# EasyEDA schematic SCH_Revised Dice Roller_2023-06-08.json
TITLE: Sheet_1; REV: 1.0; Date: 2023-04-12; Sheet: 1/1; Drawn By: monkeybank2007; Company: Your Company
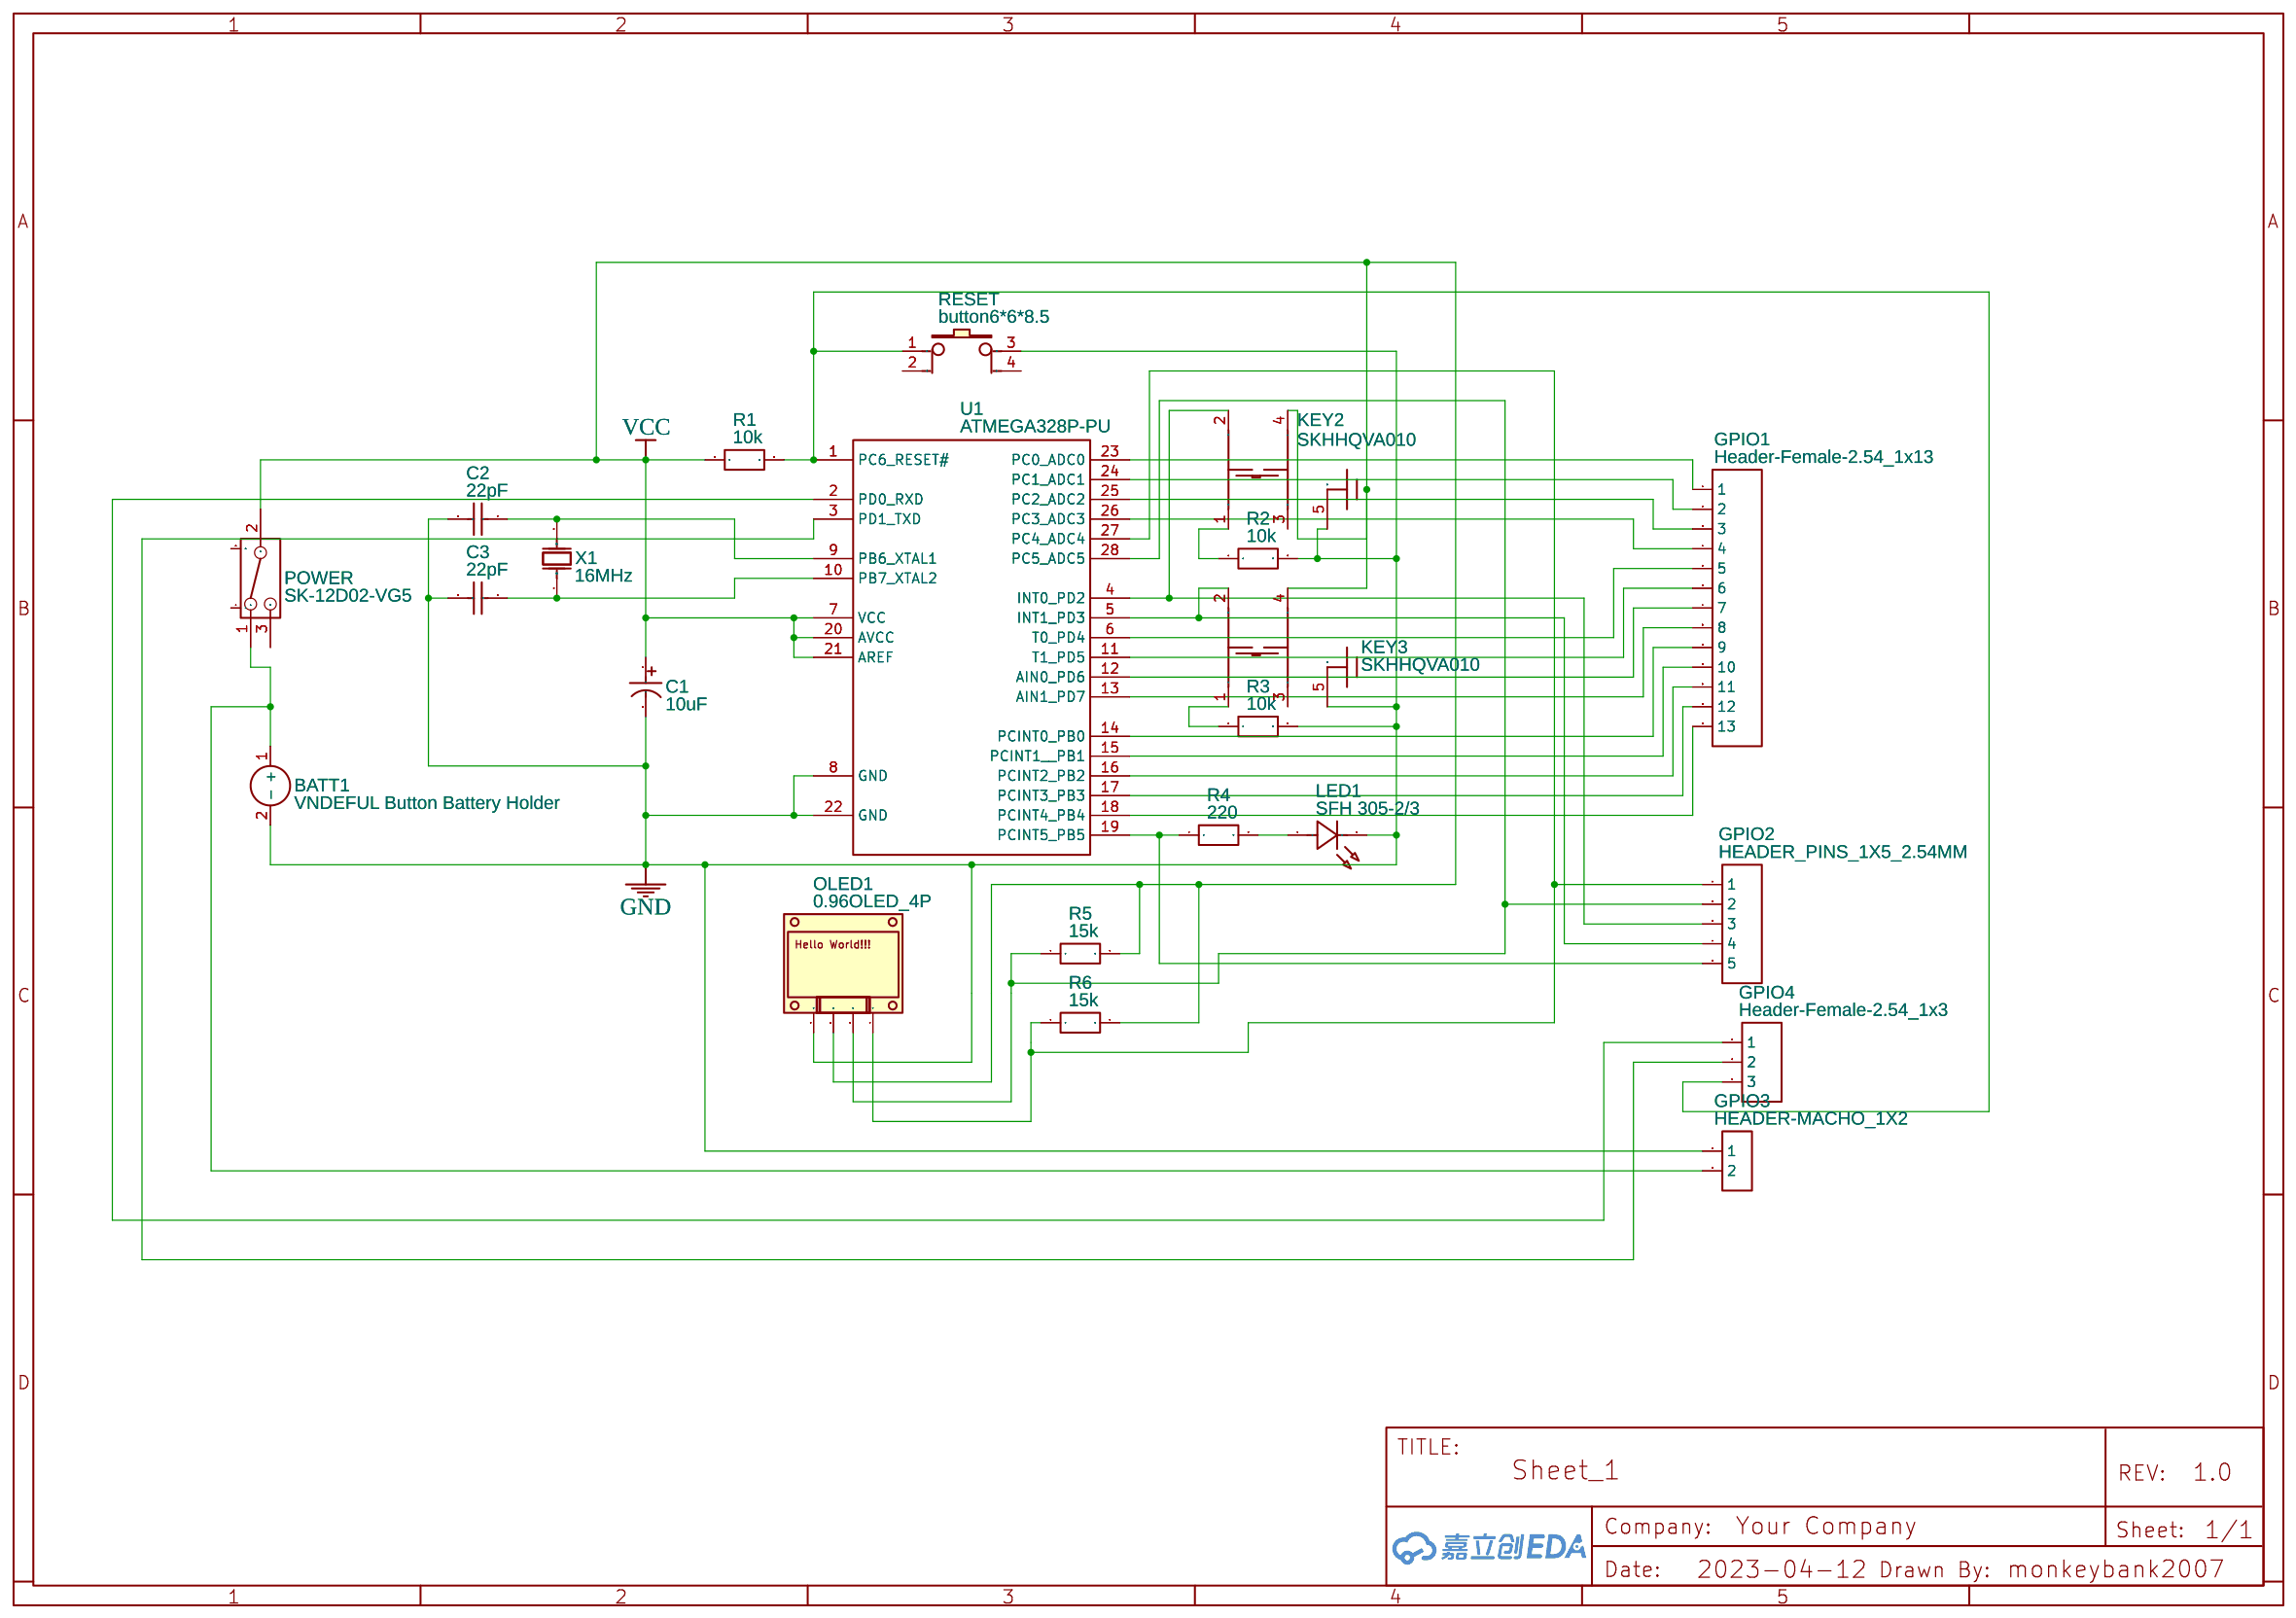
[diagram p0: schematic sheet]

## Parts
BATT1  VNDEFUL Button Battery Holder  [VNDEFUL CR2016 2025 2032 23MM X 6MM COIN CELL BUTTON BATTERY HOLDER]
C1  10uF  [CAP-TH_BD4.0-P1.50-D0.8-FD]
C2  22pF  [CAP-TH_L7.0-W3.5-P5.00-D0.6]
C3  22pF  [CAP-TH_L7.0-W3.5-P5.00-D0.6]
GPIO1  Header-Female-2.54_1x13  [HDR-TH_13P-P2.54-V-F]
GPIO2  HEADER_PINS_1X5_2.54MM  [HEADER_PINS_1X5_2.54MM]
GPIO3  HEADER-MACHO_1X2  [HEADER-1X2]
GPIO4  Header-Female-2.54_1x3  [HDR-TH_3P-P2.54-V-F]
KEY2  SKHHQVA010  [SW-TH_5P-L6.0-W6.0-P4.50-LS6.5]
KEY3  SKHHQVA010  [SW-TH_5P-L6.0-W6.0-P4.50-LS6.5]
LED1  SFH 305-2/3  [LED-TH_L2.6-W1.2-P2.54-FD]
OLED1  0.96OLED_4P  [0.96OLED_4P]
POWER  SK-12D02-VG5  [SW-TH_SK-12D02-VG5]
R1  10k  [RES-TH_BD4.6-L11.5-P15.50-D0.8]
R2  10k  [RES-TH_BD4.6-L11.5-P15.50-D0.8]
R3  10k  [RES-TH_BD4.6-L11.5-P15.50-D0.8]
R4  220  [RES-TH_BD4.6-L11.5-P15.50-D0.8]
R5  15k  [RES-TH_BD4.6-L11.5-P15.50-D0.8]
R6  15k  [RES-TH_BD4.6-L11.5-P15.50-D0.8]
RESET  button6*6*8.5  [KEY-TH_4P-L6.0-W6.0-P4.50]
U1  ATMEGA328P-PU  [DIP-28_L34.6-W7.3-P2.54-LS10.2-BL]
X1  16MHz  [CRYSTAL-TH_L11.1-W4.7]

## Library data of the parts
BATT1 = VNDEFUL Button Battery Holder: Supplier: Amazon; Supplier Part: B01J5FY2GI; link: https://www.amazon.com/gp/product/B01J5FY2GI/ref=ppx_yo_dt_b_search_asin_title?ie=UTF8&psc=1; Contributor: sims.mike
C1 = electrolytic capacitor10UF50V: Supplier: LCSC; Manufacturer: CX(承兴); Manufacturer Part: KS106M050C07RR0VH2FP0; Supplier Part: C32856; JLCPCB Part Class: Extended Part
C2 C3 = Calibration capacitor22NF（223） 100V 5%: Supplier: LCSC; Manufacturer: ReliaPro; Supplier Part: C26612
GPIO1 = Header-Female-2.54_1x13: Supplier: LCSC; Manufacturer: BOOMELE(博穆精密); Manufacturer Part: 2.54-1*13P母; Supplier Part: C52709; JLCPCB Part Class: Extended Part
GPIO2 = HEADER_PINS_1X5_2.54MM: Contributor: vblucifer
GPIO3 = HEADER-MACHO_1X2: Supplier: LCSC; Manufacturer: ReliaPro; Manufacturer Part: Header-Female-2.54_1x4; Supplier Part: C124413
GPIO4 = Header-Female-2.54_1x3: Supplier Part: C146243; Supplier: LCSC; Manufacturer: BOOMELE(博穆精密); Manufacturer Part: 2.54-1*3P母; link: https://datasheet.lcsc.com/szlcsc/Boom-Precision-Elec-2-54mm-1-8P-Straight-Female-header_C27438.pdf; JLCPCB Part Class: Extended Part
KEY2 KEY3 = SKHHQVA010: Supplier: LCSC; Supplier Part: C470256; Manufacturer: ALPSALPINE(阿尔卑斯阿尔派); Contributor: LCSC; JLCPCB Part Class: Extended Part
LED1 = SFH 305-2/3: Supplier: LCSC; Supplier Part: C2900246; Manufacturer: OSRAM; link: https://atta.szlcsc.comnull; Contributor: LCSC
OLED1 = 0.96OLED_4P: Supplier: LCSC; Contributor: LCEDA_Lib
POWER = SK-12D02-VG5: Supplier: LCSC; Supplier Part: C136722; Manufacturer: 韩国韩荣; Contributor: LCSC; JLCPCB Part Class: Extended Part
R1-R3 = PNP300JR-73-0R22: Supplier: LCSC; Supplier Part: C1742268; Manufacturer: YAGEO(国巨); link: https://atta.szlcsc.com/upload/public/pdf/source/20200814/C723742_A45AF039B45C2CB239691CFF03C62E98.pdf; Resistance: 10kΩ; Contributor: lcsc; JLCPCB Part Class: Extended Part
R4 = PNP300JR-73-0R22: Supplier: LCSC; Supplier Part: C1742268; Manufacturer: YAGEO(国巨); link: https://atta.szlcsc.com/upload/public/pdf/source/20200814/C723742_A45AF039B45C2CB239691CFF03C62E98.pdf; Resistance: 220Ω; Contributor: lcsc; JLCPCB Part Class: Extended Part
R5 R6 = PNP300JR-73-0R22: Supplier: LCSC; Supplier Part: C1742268; Manufacturer: YAGEO(国巨); link: https://atta.szlcsc.com/upload/public/pdf/source/20200814/C723742_A45AF039B45C2CB239691CFF03C62E98.pdf; Resistance: 15kΩ; Contributor: lcsc; JLCPCB Part Class: Extended Part
RESET = button6*6*8.5: Supplier Part: C59980; Supplier: LCSC; Manufacturer: ReliaPro
U1 = ATMEGA328P-PU: sourceId: Oic6oiASL; Supplier: LCSC; Manufacturer: MICROCHIP(美国微芯); Contributor: LCSC; Supplier Part: C33901; JLCPCB Part Class: Extended Part
X1 = 49SAC20000202040: Supplier: LCSC; Supplier Part: C443544; Manufacturer: JGHC(晶光华); JLCPCB Part Class: Extended Part; Contributor: lcsc

## Nets
GND: BATT1.2(-) C1.2(-) C2.1 C3.1 GPIO3.1 KEY2.5 KEY3.5 LED1.2(K) OLED1.1 R2.2 R3.2 RESET.3 U1.8(GND) U1.22(GND)
VCC: C1.1(+) KEY2.4 KEY3.4 OLED1.2 POWER.2 R1.1 R5.2 R6.2 U1.7(VCC) U1.20(AVCC) U1.21(AREF)
Net-(BATT1-1): BATT1.1(+) GPIO3.2 POWER.1
Net-(C2-2): C2.2 U1.9(PB6 XTAL1) X1.2(OSC2)
Net-(C3-2): C3.2 U1.10(PB7 XTAL2) X1.1(OSC1)
Net-(GPIO1-1): GPIO1.1 U1.23(PC0 ADC0)
Net-(GPIO1-2): GPIO1.2 U1.24(PC1 ADC1)
Net-(GPIO1-3): GPIO1.3 U1.25(PC2 ADC2)
Net-(GPIO1-4): GPIO1.4 U1.26(PC3 ADC3)
Net-(GPIO1-5): GPIO1.5 U1.6(T0 PD4)
Net-(GPIO1-6): GPIO1.6 U1.11(T1 PD5)
Net-(GPIO1-7): GPIO1.7 U1.12(AIN0 PD6)
Net-(GPIO1-8): GPIO1.8 U1.13(AIN1 PD7)
Net-(GPIO1-9): GPIO1.9 U1.14(PCINT0 PB0)
Net-(GPIO1-10): GPIO1.10 U1.15(PCINT1  PB1)
Net-(GPIO1-11): GPIO1.11 U1.16(PCINT2 PB2)
Net-(GPIO1-12): GPIO1.12 U1.17(PCINT3 PB3)
Net-(GPIO1-13): GPIO1.13 U1.18(PCINT4 PB4)
Net-(GPIO2-1): GPIO2.1 OLED1.4 R6.1 U1.27(PC4 ADC4)
Net-(GPIO2-2): GPIO2.2 OLED1.3 R5.1 U1.28(PC5 ADC5)
Net-(GPIO2-3): GPIO2.3 KEY2.2 U1.4(INT0 PD2)
Net-(GPIO2-4): GPIO2.4 KEY3.2 U1.5(INT1 PD3)
Net-(GPIO2-5): GPIO2.5 R4.1 U1.19(PCINT5 PB5)
Net-(GPIO4-1): GPIO4.1 U1.2(PD0 RXD)
Net-(GPIO4-2): GPIO4.2 U1.3(PD1 TXD)
Net-(GPIO4-3): GPIO4.3 R1.2 RESET.1 U1.1(PC6 RESET#)
Net-(KEY2-1): KEY2.1 R2.1
Net-(KEY3-1): KEY3.1 R3.1
Net-(LED1-1): LED1.1(A) R4.2

Not connected (* = marked no-connect by the designer): KEY2 3; KEY3 3; POWER 3 4 5; RESET 2 4
